# Altium schematic sheet EthIO_02A_MCU_Core.SchDoc
size A4; SheetNumber: 3; SheetTotal: 7
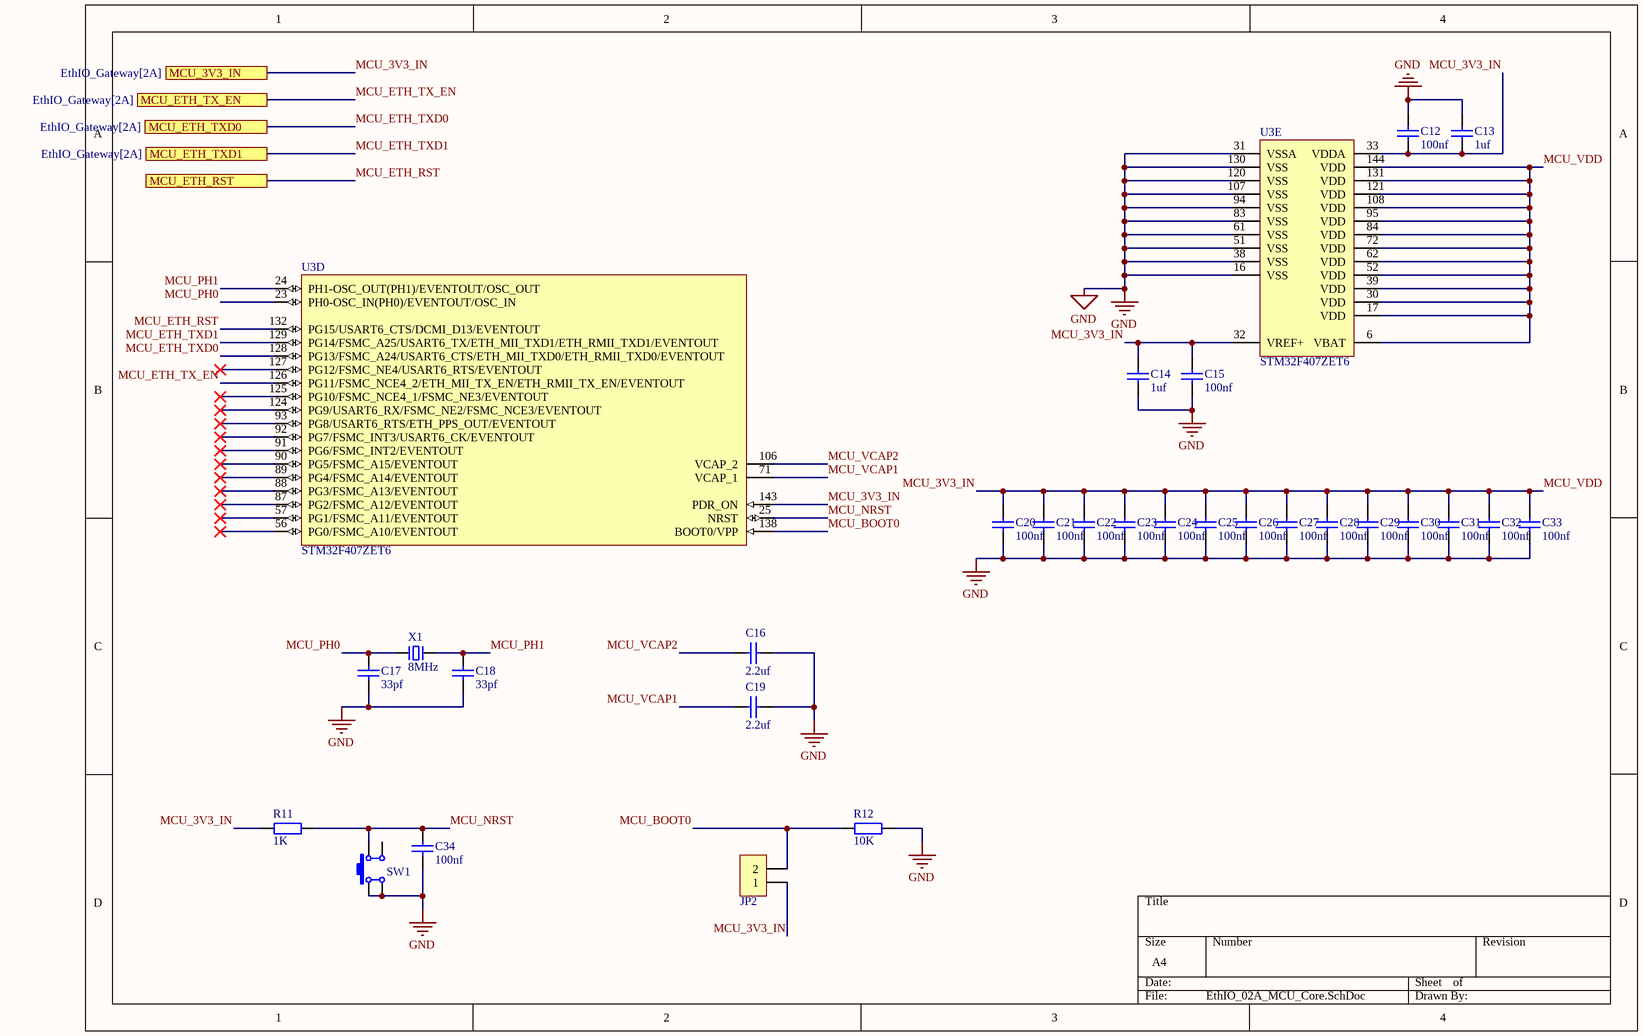
[diagram p0: EthIO_02A_MCU_Core.SchDoc]

## Parts
C12  100nf  [C0805_L]
C13  1uf  [C0805_L]
C14  1uf  [C0805_L]
C15  100nf  [C0805_L]
C16  2.2uf  [C0805_L]
C17  33pf  [C0805_L]
C18  33pf  [C0805_L]
C19  2.2uf  [C0805_L]
C20  100nf  [C0805_L]
C21  100nf  [C0805_L]
C22  100nf  [C0805_L]
C23  100nf  [C0805_L]
C24  100nf  [C0805_L]
C25  100nf  [C0805_L]
C26  100nf  [C0805_L]
C27  100nf  [C0805_L]
C28  100nf  [C0805_L]
C29  100nf  [C0805_L]
C30  100nf  [C0805_L]
C31  100nf  [C0805_L]
C32  100nf  [C0805_L]
C33  100nf  [C0805_L]
C34  100nf  [C0805_L]
JP2  HDR-1X2  [XH2.54-LI-2P]  (value not drawn)
R11  1K  [R0805_L]
R12  10K  [R0805_L]
SW1  12x12x5  [SW DIP-12*12*4.3]  (value not drawn)
U3  STM32F407ZET6  [TQFP144_V]  (parts D,E of 5)
X1  8MHz  [HC-49S]

## Ports
MCU_3V3_IN (see EthIO_Gateway[2A]), MCU_ETH_RST, MCU_ETH_TX_EN (see EthIO_Gateway[2A]), MCU_ETH_TXD0 (see EthIO_Gateway[2A]), MCU_ETH_TXD1 (see EthIO_Gateway[2A])

## Nets
GND: C12.2 C13.2 C14.2 C15.2 C16.2 C17.2 C18.2 C19.2 C20.2 C21.2 C22.2 C23.2 C24.2 C25.2 C26.2 C27.2 C28.2 C29.2 C30.2 C31.2 C32.2 C33.2 C34.2 R12.2 SW1.1 SW1.4 U3.16(VSS) U3.31(VSSA) U3.38(VSS) U3.51(VSS) U3.61(VSS) U3.83(VSS) U3.94(VSS) U3.107(VSS) U3.120(VSS) U3.130(VSS)
MCU_3V3_IN: C12.1 C13.1 C14.1 C15.1 C20.1 C21.1 C22.1 C23.1 C24.1 C25.1 C26.1 C27.1 C28.1 C29.1 C30.1 C31.1 C32.1 C33.1 JP2.1 R11.1 U3.6(VBAT) U3.17(VDD) U3.30(VDD) U3.32(VREF+) U3.33(VDDA) U3.39(VDD) U3.52(VDD) U3.62(VDD) U3.72(VDD) U3.84(VDD) U3.95(VDD) U3.108(VDD) U3.121(VDD) U3.131(VDD) U3.143(PDR_ON) U3.144(VDD) ; port MCU_3V3_IN  [also labelled MCU_VDD]
MCU_BOOT0: JP2.2 R12.1 U3.138(BOOT0/VPP)
MCU_ETH_RST: U3.132(PG15/USART6_CTS/DCMI_D13/EVENTOUT) ; port MCU_ETH_RST
MCU_ETH_TX_EN: U3.126(PG11/FSMC_NCE4_2/ETH_MII_TX_EN/ETH_RMII_TX_EN/EVENTOUT) ; port MCU_ETH_TX_EN
MCU_ETH_TXD0: U3.128(PG13/FSMC_A24/USART6_CTS/ETH_MII_TXD0/ETH_RMII_TXD0/EVENTOUT) ; port MCU_ETH_TXD0
MCU_ETH_TXD1: U3.129(PG14/FSMC_A25/USART6_TX/ETH_MII_TXD1/ETH_RMII_TXD1/EVENTOUT) ; port MCU_ETH_TXD1
MCU_NRST: C34.1 R11.2 SW1.2 U3.25(NRST)
MCU_PH0: C17.1 U3.23(PH0-OSC_IN(PH0)/EVENTOUT/OSC_IN) X1.1
MCU_PH1: C18.1 U3.24(PH1-OSC_OUT(PH1)/EVENTOUT/OSC_OUT) X1.2
MCU_VCAP1: C19.1 U3.71(VCAP_1)
MCU_VCAP2: C16.1 U3.106(VCAP_2)

Not connected (* = marked no-connect by the designer): SW1 3; U3 56(PG0/FSMC_A10/EVENTOUT)* 57(PG1/FSMC_A11/EVENTOUT)* 87(PG2/FSMC_A12/EVENTOUT)* 88(PG3/FSMC_A13/EVENTOUT)* 89(PG4/FSMC_A14/EVENTOUT)* 90(PG5/FSMC_A15/EVENTOUT)* 91(PG6/FSMC_INT2/EVENTOUT)* 92(PG7/FSMC_INT3/USART6_CK/EVENTOUT)* 93(PG8/USART6_RTS/ETH_PPS_OUT/EVENTOUT)* 124(PG9/USART6_RX/FSMC_NE2/FSMC_NCE3/EVENTOUT)* 125(PG10/FSMC_NCE4_1/FSMC_NE3/EVENTOUT)* 127(PG12/FSMC_NE4/USART6_RTS/EVENTOUT)*

## Library data of the parts
C12-C34 = C: 贴片电容/MLCC电容; BOM名称: 无极性贴片电容; 当前库版本V2022.12.25 @淘宝卖家:黄晶宝石: 最新版本发布https://shop463601444.taobao.com
JP2 = Header 2: 跳帽; BOM名称: 2P接插件; 联系卖家，免费查找封装: 唯一出售店铺网址https://shop463601444.taobao.com; 封装库来自淘宝卖家ID：黄晶宝石: 其他店铺购入均为盗版封装库，请立即申请退款，本店现金奖励50~200元
R11 R12 = R: 贴片电阻; 联系下单店铺卖家 免费帮你查找封装: 联系下单店铺卖家 免费技术支持; BOM名称: 贴片电阻
SW1 = SW DIP-12x12: 直插12x12轻触开关; 联系下单店铺卖家 免费技术支持: 联系下单店铺卖家 免费帮你查找封装; BOM名称: 直插12x12轻触开关
U3 = STM32F407ZET6: ARM Cortex-M4 32b MCU+FPU, 210DMIP, 512 kB Flash, 192+4 kB RAM, Camera, 114 I/Os, 144-pin LQFP, -40 to +85癈, Tray; Internal RAM: 192kB; Operating Frequency (Processor Speed): 168MHz; A/D Converter: 24x12-bit; D/A Converter: 2x12-bit; 16-bit Timers (IC/OC/PWM): 12x16-bit(24/24/30); 32-bit Timer (IC/OC/PWM): 2x32-bit (8/8/8); Other Timer Functions: 2xWDG, RTC, 24-bit down counter; Serial Interface: 3xSPI/2xI2S/2xI2C/3xUSART(IrDa, ISO7816)/3xUART/2xUSB OTG FS/HS, 2xCAN/Ethernet MAC10/100, SDIO; 联系卖家，免费查找封装: 唯一出售店铺网址https://shop463601444.taobao.com; DatasheetVersion: rev2, Jan-2012; PackageVersion: 2012; PackageReference: TQFP144; PackageDescription: 144-Pin Low Profile Quad Flat Package, 20x20 mm Body, 0.5 mm Pitch; ComponentLink1Description: Manufacturer URL; ComponentLink1URL: http://www.st.com/; ComponentLink2Description: STM32F405/7 Datasheet; ComponentLink2URL: http://www.st.com/internet/com/TECHNICAL_RESOURCES/TECHNICAL_LITERATURE/DATASHEET/DM00037051.pdf; ComponentLink3Description: STM32F4 Web Page; ComponentLink3URL: http://www.st.com/internet/mcu/subclass/1521.jsp
X1 = XTAL-2P: 2脚无源晶振(谐振器）; 联系下单店铺卖家 免费帮你查找封装: 联系下单店铺卖家 免费技术支持; BOM名称: 2脚无源晶振(谐振器）